# Altium schematic sheet connectors.SchDoc
size A4
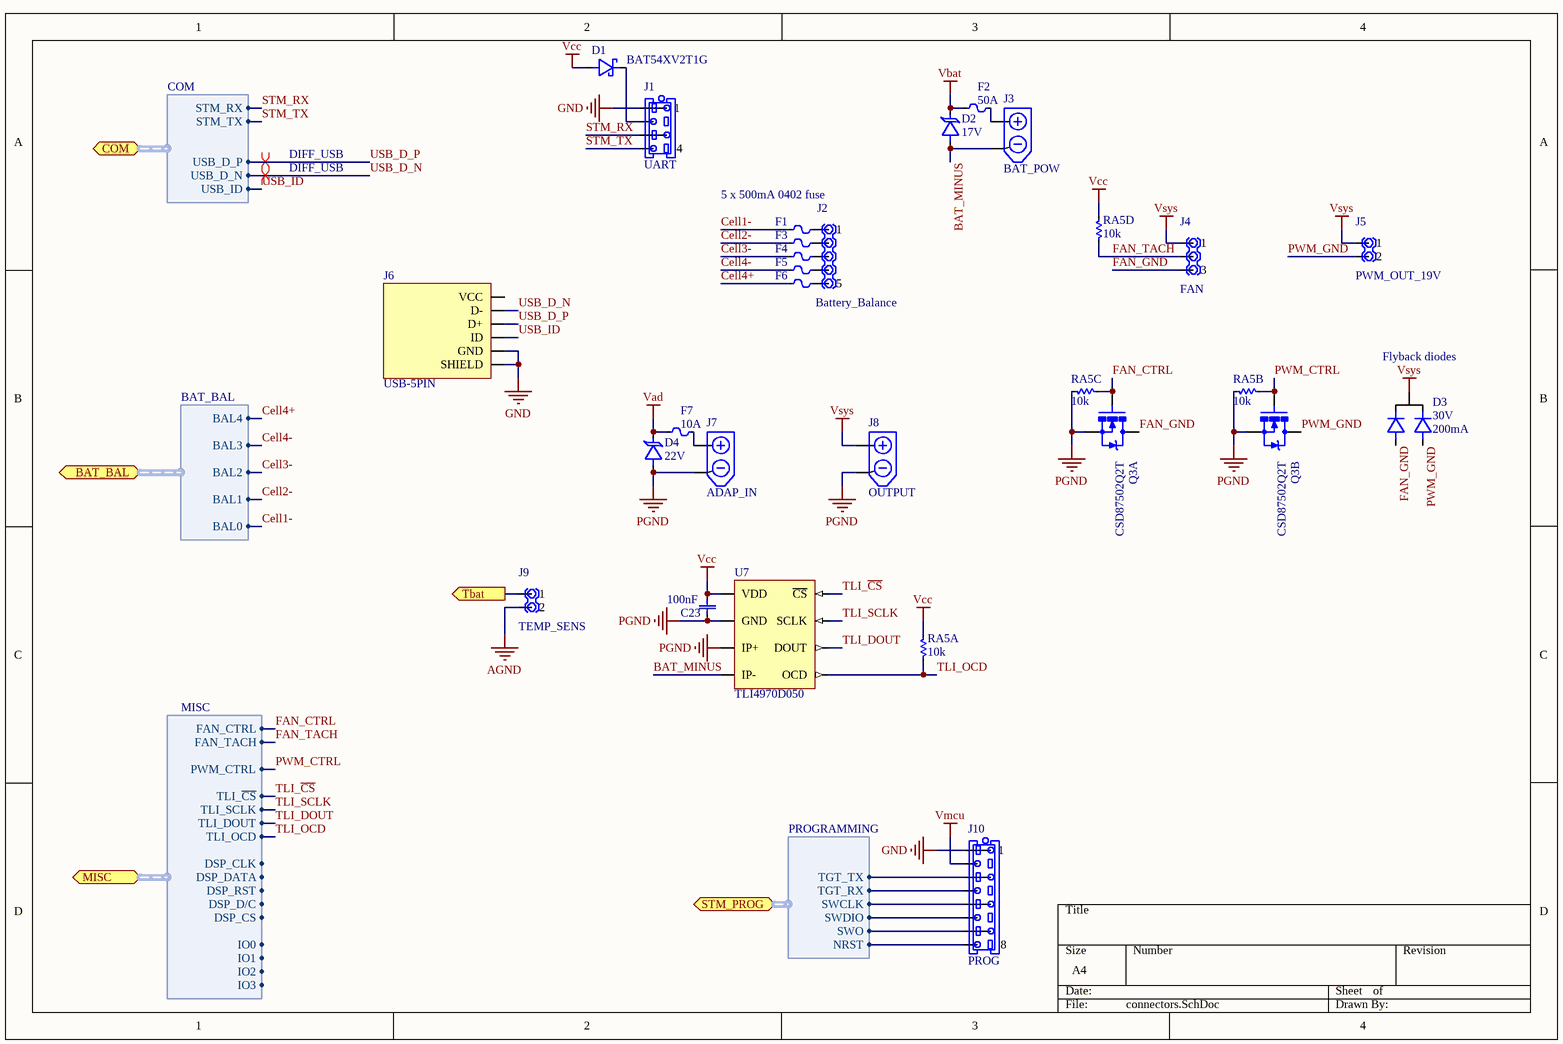
[diagram p0: connectors.SchDoc]

## Parts
C23  Capacitance: 100nF  [CAP0402]  (hidden comment: 0nF)
D1  BAT54XV2T1G  [SOD523]
D2  Reverse stand-off voltage: 17V  [SOD123W]  (hidden comment: PTVS17VS1UR)
D3  Reverse voltage: 30V  Forward current: 200mA  [SOT65P210X110-3L]  (hidden comment: BAT54CWT1G)
D4  Reverse stand-off voltage: 22V  [SOD123W]  (hidden comment: PTVS22VS1UR)
F1  fuse  [FUSE-0402]  (value not drawn)
F2  Rated current: 50A  [FUSE-1206]  (hidden comment: fuse)
F3  fuse  [FUSE-0402]  (value not drawn)
F4  fuse  [FUSE-0402]  (value not drawn)
F5  fuse  [FUSE-0402]  (value not drawn)
F6  fuse  [FUSE-0402]  (value not drawn)
F7  Rated current: 10A  [FUSE-1206]  (hidden comment: fuse)
J1  UART  [MICRO-MATCH-4]
J2  Battery_Balance  [JST-XH-5-TOP]
J3  BAT_POW  [XT60_male]
J4  FAN  [Pin Header 1x3 TH Pitch 2.54mm]
J5  PWM_OUT_19V  [Pin Header 1x2 TH Pitch 2.54mm]
J6  USB-5PIN  [USB-B-MICRO-473460001]
J7  ADAP_IN  [XT60_male]
J8  OUTPUT  [XT60_male]
J9  TEMP_SENS  [Pin Header 1x2 TH Pitch 2.54mm]
J10  PROG  [MICRO-MATCH-8]
Q3  CSD87502Q2T  [SON65P200X80_HS-7L_DUALFET]  (parts A,B of 2)
RA5  Resistance: 10k  [CAC-50P200X100-8L]  (hidden comment: quad_resistor)  (parts A,B,C,D of 4)
U7  TLI4970D050  [PG-TISON-8-1]

## Ports
BAT_BAL (harness BAT_BAL), COM (harness COM), MISC (harness MISC), STM_PROG (harness PROGRAMMING), Tbat (out)

## Harnesses
BAT_BAL: BAL0, BAL1, BAL2, BAL3, BAL4
MISC: FAN_CTRL, PWM_CTRL, FAN_TACH, DSP_CLK, DSP_DATA, DSP_RST, DSP_D/C, DSP_CS, IO0, TLI_~{CS}, TLI_SCLK, TLI_DOUT, TLI_OCD, IO1, IO2, IO3
PROGRAMMING: NRST, SWDIO, SWCLK, TGT_RX, TGT_TX, SWO
COM: STM_RX, STM_TX, USB_D_P, USB_D_N, USB_ID

## Nets
AGND: J9.2
GND: J1.1 J6.5(GND) J6.6(SHIELD) J10.1
PGND: C23.1 D4.A(Anode) J7.1(-) J8.1(-) Q3.S1 Q3.S2 RA5.5 RA5.6 U7.1(GND) U7.7(IP+)
Vad: D4.C(Cathode) F7.1
Vbat: D2.C(Cathode) F2.1
Vcc: C23.2 D1.A(Anode) RA5.7 RA5.8 U7.2(VDD)
Vmcu: J10.2
Vsys: D3.C(Cathode) J4.1 J5.1 J8.2(+)
BAT_MINUS: D2.A(Anode) J3.1(-) U7.8(IP-)
Cell1-: F1.1 ; port BAT_BAL.BAL0
Cell2-: F3.1 ; port BAT_BAL.BAL1
Cell3-: F4.1 ; port BAT_BAL.BAL2
Cell4+: F6.1 ; port BAT_BAL.BAL4
Cell4-: F5.1 ; port BAT_BAL.BAL3
FAN_CTRL: Q3.G1 RA5.4 ; port MISC.FAN_CTRL
FAN_GND: D3.A1(Anode1) J4.3 Q3.D1
FAN_TACH: J4.2 RA5.2 ; port MISC.FAN_TACH
PWM_CTRL: Q3.G2 RA5.3 ; port MISC.PWM_CTRL
PWM_GND: D3.A2(Anode2) J5.2 Q3.D2
STM_RX: J1.3 ; port COM.STM_RX
STM_TX: J1.4 ; port COM.STM_TX
Tbat: J9.1 ; port Tbat
TLI_~{CS}: U7.5(~{CS}) ; port MISC.TLI_~{CS}
TLI_DOUT: U7.3(DOUT) ; port MISC.TLI_DOUT
TLI_OCD: RA5.1 U7.6(OCD) ; port MISC.TLI_OCD
TLI_SCLK: U7.4(SCLK) ; port MISC.TLI_SCLK
USB_D_N: J6.2(D-) ; port COM.USB_D_N
USB_D_P: J6.3(D+) ; port COM.USB_D_P
USB_ID: J6.4(ID) ; port COM.USB_ID
NetD1_C: D1.C(Cathode) J1.2
NetF1_2: F1.2 J2.1
NetF2_2: F2.2 J3.2(+)
NetF3_2: F3.2 J2.2
NetF4_2: F4.2 J2.3
NetF5_2: F5.2 J2.4
NetF6_2: F6.2 J2.5
NetF7_2: F7.2 J7.2(+)
NetJ10_3: J10.3 ; port STM_PROG.TGT_TX
NetJ10_4: J10.4 ; port STM_PROG.TGT_RX
NetJ10_5: J10.5 ; port STM_PROG.SWCLK
NetJ10_6: J10.6 ; port STM_PROG.SWDIO
NetJ10_7: J10.7 ; port STM_PROG.SWO
NetJ10_8: J10.8 ; port STM_PROG.NRST

Not connected (* = marked no-connect by the designer): J6 1(VCC)

## Layout directives
differential pair; net class DIFF_USB: USB_D_N, USB_D_P

## Notes on the sheet
- 5 x 500mA 0402 fuse
- (near D3) Flyback diodes

## Library data of the parts
C23 = capacitor: Max voltage: 25V; Tolerance: 10%
D1 = Schottky diode: Peak forward current: 1A; Max forward voltage: 0.5V; Reverse voltage: 30V; Forward current: 200mA
D2 = TVS-DIODE: Peak pulse power dissipation: 400W; Clamping voltage: 27.6
D3 = DUAL-DIODE-CC: pin to pad: A1>1 A2>2 C>3; Peak forward current: 600mA; Max forward voltage: 0.5V
D4 = TVS-DIODE: Peak pulse power dissipation: 400W; Clamping voltage: 35.5V
F1 F3-F6 = fuse: Power: 0.063W; Rated voltage DC: 24V; Blow characteristic: Slow blow; Rated voltage AC: 12V; Breaking current: 2A; Rated current: 500mA
F2 F7 = fuse: Power: 0.063W; Rated voltage DC: 24V; Blow characteristic: Slow blow; Rated voltage AC: 12V; Breaking current: 2A
J1 = MICRO-MATCH-4
J2 = HEADER-5
J3 J7 J8 = XT60
J4 = HEADER-3
J5 J9 = HEADER-2
J6 = USB-5PIN: pin to pad: 6>SHLD
J10 = MICRO-MATCH-8
Q3 = DUAL-NFET: PROD_ID: IC-08089
U7 = TLI4970: High precision miniature coreless magnetic current sensor for AC and DC  measurements with digital interface and fast overcurrent detection; Measurement range: ±50A